# Altium schematic sheet Controller.SchDoc
size 297 x 209 mm; SheetNumber: 4; SheetTotal: 11
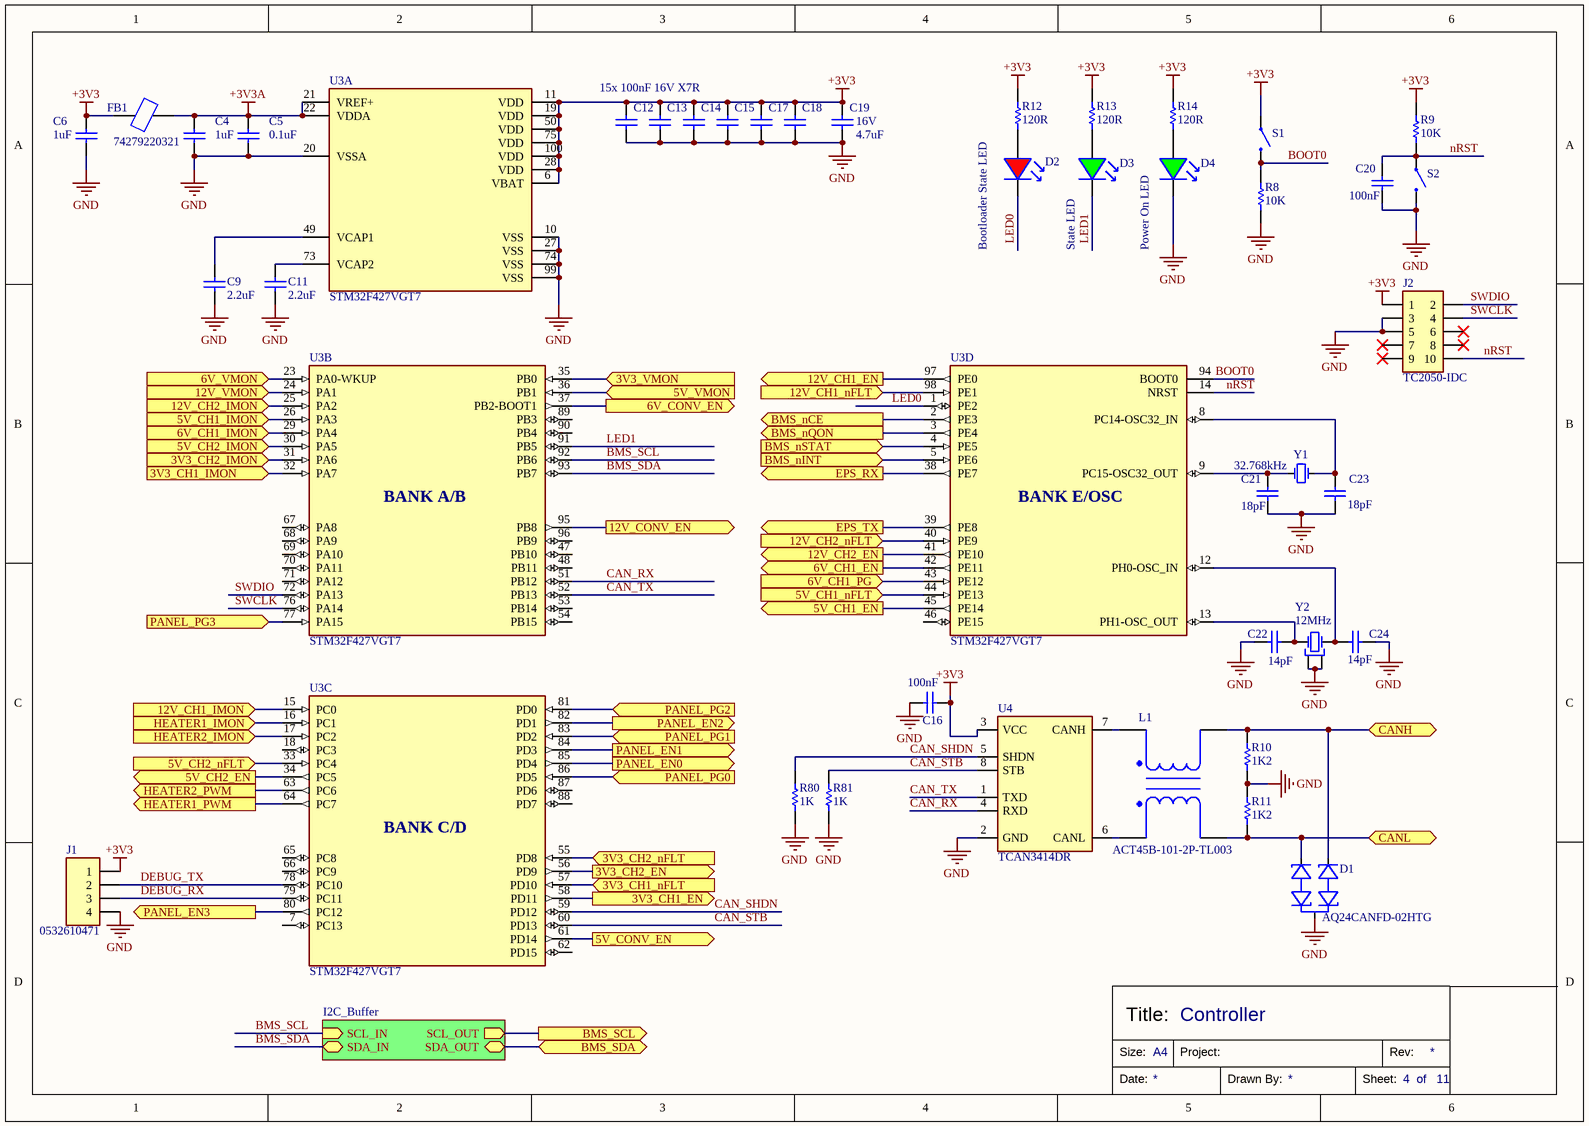
[diagram p0: Controller.SchDoc]

## Parts
C4  Capacitance: 1uF  [CAPC0603X040]  (hidden comment: CL10B105KO8NNNC)
C5  Capacitance: 0.1uF  [CAPC0402X020]  (hidden comment: CL05B104KB5NNNC)
C6  Capacitance: 1uF  [CAPC0603X040]  (hidden comment: CL10B105KO8NNNC)
C9  Capacitance: 2.2uF  [CAPC0805X060]  (hidden comment: CL21A225KBFNNNE)
C11  Capacitance: 2.2uF  [CAPC0805X060]  (hidden comment: CL21A225KBFNNNE)
C12  CL05B104KB5NNNC  [CAPC0402X020]  (value not drawn)
C13  CL05B104KB5NNNC  [CAPC0402X020]  (value not drawn)
C14  CL05B104KB5NNNC  [CAPC0402X020]  (value not drawn)
C15  CL05B104KB5NNNC  [CAPC0402X020]  (value not drawn)
C16  Capacitance: 100nF  [CAPC0603X040]  (hidden comment: C0603C104K5RACTU)
C17  CL05B104KB5NNNC  [CAPC0402X020]  (value not drawn)
C18  CL05B104KB5NNNC  [CAPC0402X020]  (value not drawn)
C19  Voltage Rating: 16V  Capacitance: 4.7uF  [CAPC0805X060]  (hidden comment: CL21B475KOFNFNE)
C20  Capacitance: 100nF  [CAPC0603X040]  (hidden comment: C0603C104K5RACTU)
C21  Capacitance: 18pF  [CAPC0402X020]  (hidden comment: KGM05ACG1H180FH)
C22  Capacitance: 14pF  [CAPC0402X020]  (hidden comment: GJM1555C1H140FB01D)
C23  Capacitance: 18pF  [CAPC0402X020]  (hidden comment: KGM05ACG1H180FH)
C24  Capacitance: 14pF  [CAPC0402X020]  (hidden comment: GJM1555C1H140FB01D)
D1  AQ24CANFD-02HTG  [SOT23-3 IC]
D2  LTST-C170EKT  [LEDR_0805]  (value not drawn)
D3  LTST-C170GKT  [LEDG_0805]  (value not drawn)
D4  LTST-C170GKT  [LEDG_0805]  (value not drawn)
FB1  74279220321  [74279220321]
J1  0532610471  [0532610471]
J2  TC2050-IDC  [TC2050-IDC]  (no BOM)
L1  ACT45B-101-2P-TL003  [ACT45B-101-2P-TL003]
R8  Resistance: 10K  [RESC0805]  (hidden comment: RMCF0805FT10K0)
R9  Resistance: 10K  [RESC0805]  (hidden comment: RMCF0805FT10K0)
R10  Resistance: 1K2  [RESC0603]  (hidden comment: RMCF0603FT1K20)
R11  Resistance: 1K2  [RESC0603]  (hidden comment: RMCF0603FT1K20)
R12  Resistance: 120R  [RESC0805]  (hidden comment: RMCF0805FT120R)
R13  Resistance: 120R  [RESC0805]  (hidden comment: RMCF0805FT120R)
R14  Resistance: 120R  [RESC0805]  (hidden comment: RMCF0805FT120R)
R80  Resistance: 1K  [RESC0805]  (hidden comment: RNCP0805FTD1K00)
R81  Resistance: 1K  [RESC0805]  (hidden comment: RNCP0805FTD1K00)
S1  B3U-1000P  [B3U-1000P]  (value not drawn)
S2  B3U-1000P  [B3U-1000P]  (value not drawn)
U3  STM32F427VGT7  [STM32F427VGT7]  (parts A,B,C,D of 4)
U4  TCAN3414DR  [SOIC-8]
Y1  Frequency: 32.768kHz  [CM7VT1A32.768KHZ125PF20PPMTBQAT3]  (hidden comment: CM7VT1A32.768KHZ125PF20PPMTBQAT3)
Y2  Frequency: 12MHz  [830069882]  (hidden comment: 830069882)

## Sub-sheets
I2C_Buffer = I2C_Buffer: SCL_IN (in), SDA_IN (bidir), SCL_OUT (out), SDA_OUT (bidir)

## Ports
3V3_CH1_EN (out, see PDM[4A], 3V3_Supply[4B]), 3V3_CH1_IMON (in, see PDM[4A], 3V3_Supply[2D]), 3V3_CH1_nFLT (in, see PDM[4A], 3V3_Supply[4B]), 3V3_CH2_EN (out, see PDM[4A], 3V3_Supply[4C]), 3V3_CH2_IMON (in, see PDM[4A], 3V3_Supply[5D]), 3V3_CH2_nFLT (in, see PDM[4A], 3V3_Supply[4C]), 3V3_VMON (in, see PDM[4A], 3V3_Supply[2C]), 5V_CH1_EN (out, see PDM[4B], 5V_Supply[4B]), 5V_CH1_IMON (in, see PDM[4B], 5V_Supply[2D]), 5V_CH1_nFLT (in, see PDM[4B], 5V_Supply[4B]), 5V_CH2_EN (out, see PDM[4B], 5V_Supply[4C]), 5V_CH2_IMON (in, see PDM[4B], 5V_Supply[4D]), 5V_CH2_nFLT (in, see PDM[4B], 5V_Supply[4C]), 5V_CONV_EN (out, see PDM[4B], 5V_Supply[1B]), 5V_VMON (in, see PDM[4B], 5V_Supply[2C]), 6V_CH1_EN (out, see PDM[4C], 6V_Supply[3C]), 6V_CH1_IMON (in, see PDM[4C], 6V_Supply[2D]), 6V_CH1_PG (in, see PDM[4C], 6V_Supply[4C]), 6V_CONV_EN (out, see PDM[4C], 6V_Supply[1B]), 6V_VMON (in, see PDM[4C], 6V_Supply[2C]), 12V_CH1_EN (out, see PDM[4C], 12V_Supply[4B]), 12V_CH1_IMON (in, see PDM[4D], 12V_Supply[2D]), 12V_CH1_nFLT (in, see PDM[4C], 12V_Supply[4B]), 12V_CH2_EN (out, see PDM[4C], 12V_Supply[4C]), 12V_CH2_IMON (in, see PDM[4D], 12V_Supply[4D]), 12V_CH2_nFLT (in, see PDM[4C], 12V_Supply[4C]), 12V_CONV_EN (out, see PDM[4C], 12V_Supply[1B]), 12V_VMON (in, see PDM[4C], 12V_Supply[2C]), BMS_nCE (out, see PDM[3B]), BMS_nINT (in, see PDM[3B]), BMS_nQON (out, see PDM[3B]), BMS_nSTAT (in, see PDM[3B]), BMS_SCL (out, see PDM[3B]), BMS_SDA (bidir, see PDM[3B]), CANH (bidir, see PDM[3C], PC104[2B]), CANL (bidir, see PDM[3C], PC104[2B]), EPS_RX (out, see PDM[3C], PC104[3B]), EPS_TX (out, see PDM[3C], PC104[3B]), HEATER1_IMON (in, see PDM[3A]), HEATER1_PWM (out, see PDM[3A]), HEATER2_IMON (in, see PDM[3B]), HEATER2_PWM (out, see PDM[3B]), PANEL_EN0 (out, see PDM[3B]), PANEL_EN1 (out, see PDM[3B]), PANEL_EN2 (out, see PDM[3B]), PANEL_EN3 (out, see PDM[3B]), PANEL_PG0 (in, see PDM[3B]), PANEL_PG1 (in, see PDM[3B]), PANEL_PG2 (in, see PDM[3B]), PANEL_PG3 (in, see PDM[3B])

## Nets
+3V3: C6.2 C12.2 C13.2 C14.2 C15.2 C16.2 C17.2 C18.2 C19.2 FB1.1 J1.1 J2.1 R9.2 R12.2 R13.2 R14.2 S1.1 U3.6(VBAT) U3.11(VDD) U3.19(VDD) U3.28(VDD) U3.50(VDD) U3.75(VDD) U3.100(VDD) U4.3(VCC)
+3V3A: C4.2 C5.2 FB1.2 U3.21(VREF+) U3.22(VDDA)
GND: C4.1 C5.1 C6.1 C9.1 C11.1 C12.1 C13.1 C14.1 C15.1 C16.1 C17.1 C18.1 C19.1 C20.1 C21.1 C22.1 C23.2 C24.1 D1.3 D4.K J1.4 J2.3 J2.5 R8.1 R10.1 R11.2 R80.1 R81.1 S2.2 U3.10(VSS) U3.20(VSSA) U3.27(VSS) U3.74(VSS) U3.99(VSS) U4.2(GND) Y2.2(OSC1) Y2.4(OSC1)
3V3_CH1_EN: U3.58(PD11) ; port 3V3_CH1_EN
3V3_CH1_IMON: U3.32(PA7) ; port 3V3_CH1_IMON
3V3_CH1_nFLT: U3.57(PD10) ; port 3V3_CH1_nFLT
3V3_CH2_EN: U3.56(PD9) ; port 3V3_CH2_EN
3V3_CH2_IMON: U3.31(PA6) ; port 3V3_CH2_IMON
3V3_CH2_nFLT: U3.55(PD8) ; port 3V3_CH2_nFLT
3V3_VMON: U3.35(PB0) ; port 3V3_VMON
5V_CH1_EN: U3.45(PE14) ; port 5V_CH1_EN
5V_CH1_IMON: U3.26(PA3) ; port 5V_CH1_IMON
5V_CH1_nFLT: U3.44(PE13) ; port 5V_CH1_nFLT
5V_CH2_EN: U3.34(PC5) ; port 5V_CH2_EN
5V_CH2_IMON: U3.30(PA5) ; port 5V_CH2_IMON
5V_CH2_nFLT: U3.33(PC4) ; port 5V_CH2_nFLT
5V_CONV_EN: U3.61(PD14) ; port 5V_CONV_EN
5V_VMON: U3.36(PB1) ; port 5V_VMON
6V_CH1_EN: U3.42(PE11) ; port 6V_CH1_EN
6V_CH1_IMON: U3.29(PA4) ; port 6V_CH1_IMON
6V_CH1_PG: U3.43(PE12) ; port 6V_CH1_PG
6V_CONV_EN: U3.37(PB2-BOOT1) ; port 6V_CONV_EN
6V_VMON: U3.23(PA0-WKUP) ; port 6V_VMON
12V_CH1_EN: U3.97(PE0) ; port 12V_CH1_EN
12V_CH1_IMON: U3.15(PC0) ; port 12V_CH1_IMON
12V_CH1_nFLT: U3.98(PE1) ; port 12V_CH1_nFLT
12V_CH2_EN: U3.41(PE10) ; port 12V_CH2_EN
12V_CH2_IMON: U3.25(PA2) ; port 12V_CH2_IMON
12V_CH2_nFLT: U3.40(PE9) ; port 12V_CH2_nFLT
12V_CONV_EN: U3.95(PB8) ; port 12V_CONV_EN
12V_VMON: U3.24(PA1) ; port 12V_VMON
BMS_nCE: U3.2(PE3) ; port BMS_nCE
BMS_nINT: U3.5(PE6) ; port BMS_nINT
BMS_nQON: U3.3(PE4) ; port BMS_nQON
BMS_nSTAT: U3.4(PE5) ; port BMS_nSTAT
BMS_SCL: U3.92(PB6) ; sheet I2C_Buffer/SCL_IN
BMS_SCL: port BMS_SCL, sheet I2C_Buffer/SCL_OUT  [a separate net that carries the same name]
BMS_SDA: U3.93(PB7) ; sheet I2C_Buffer/SDA_IN
BMS_SDA: port BMS_SDA, sheet I2C_Buffer/SDA_OUT  [a separate net that carries the same name]
BOOT0: R8.2 S1.2 U3.94(BOOT0)
CAN_RX: U3.51(PB12) U4.4(RXD)
CAN_SHDN: R80.2 U3.59(PD12) U4.5(SHDN)
CAN_STB: R81.2 U3.60(PD13) U4.8(STB)
CAN_TX: U3.52(PB13) U4.1(TXD)
CANH: D1.1 L1.4 R10.2 ; port CANH
CANL: D1.2 L1.3 R11.1 ; port CANL
DEBUG_RX: J1.3 U3.79(PC11)
DEBUG_TX: J1.2 U3.78(PC10)
EPS_RX: U3.38(PE7) ; port EPS_RX
EPS_TX: U3.39(PE8) ; port EPS_TX
HEATER1_IMON: U3.16(PC1) ; port HEATER1_IMON
HEATER1_PWM: U3.64(PC7) ; port HEATER1_PWM
HEATER2_IMON: U3.17(PC2) ; port HEATER2_IMON
HEATER2_PWM: U3.63(PC6) ; port HEATER2_PWM
LED0: D2.K U3.1(PE2)
LED1: D3.K U3.91(PB5)
nRST: C20.2 J2.10 R9.1 S2.1 U3.14(NRST)
PANEL_EN0: U3.85(PD4) ; port PANEL_EN0
PANEL_EN1: U3.84(PD3) ; port PANEL_EN1
PANEL_EN2: U3.82(PD1) ; port PANEL_EN2
PANEL_EN3: U3.80(PC12) ; port PANEL_EN3
PANEL_PG0: U3.86(PD5) ; port PANEL_PG0
PANEL_PG1: U3.83(PD2) ; port PANEL_PG1
PANEL_PG2: U3.81(PD0) ; port PANEL_PG2
PANEL_PG3: U3.77(PA15) ; port PANEL_PG3
SWCLK: J2.4 U3.76(PA14)
SWDIO: J2.2 U3.72(PA13)
NetC9_2: C9.2 U3.49(VCAP1)
NetC11_2: C11.2 U3.73(VCAP2)
NetC21_2: C21.2 U3.9(PC15-OSC32_OUT) Y1.1(OSC1)
NetC22_2: C22.2 U3.13(PH1-OSC_OUT) Y2.1(OSC1)
NetC23_1: C23.1 U3.8(PC14-OSC32_IN) Y1.2(OSC2)
NetC24_2: C24.2 U3.12(PH0-OSC_IN) Y2.3(OSC2)
NetD2_A: D2.A R12.1
NetD3_A: D3.A R13.1
NetD4_A: D4.A R14.1
NetL1_1: L1.1 U4.7(CANH)
NetL1_2: L1.2 U4.6(CANL)

Not connected (* = marked no-connect by the designer): J2 6* 7* 8* 9*; U3 7(PC13) 18(PC3) 46(PE15) 47(PB10) 48(PB11) 53(PB14) 54(PB15) 62(PD15) 65(PC8) 66(PC9) 67(PA8) 68(PA9) 69(PA10) 70(PA11) 71(PA12) 87(PD6) 88(PD7) 89(PB3) 90(PB4) 96(PB9)

## Notes on the sheet
- 15x 100nF 16V X7R
- Bootloader State LED
- (near D3) State LED
- (near D4) Power On LED
- Controller
- Size:
- Title:
- A4
- Project:
- Rev:
- Date:
- Drawn By:
- Sheet:
- of
- (in symbol STM32F427VGT7, part B) BANK A/B
- (in symbol STM32F427VGT7, part C) BANK C/D
- (in symbol STM32F427VGT7, part D) BANK E/OSC

## Library data of the parts
C4 C6 = CAPC0603: 1 µF ±10% 16V Ceramic Capacitor X7R 0603 (1608 Metric); Manufacturer Part Number: CL10B105KO8NNNC; Tolerance: 10%; Distributor Part number: 1276-1019-1-ND; Case Code: 0603; Voltage Rating: 16V; Distributor: Digikey
C5 = CL05B104KB5NNNC: 0.1 µF ±10% 50V Ceramic Capacitor X7R 0402 (1005 Metric); Part Number: CL05B104KB5NNNC; Tolerance: 10%; Distributor Part Number: 1276-CL05B104KB5NNNCCT-ND; Case Code: 0402; Distributor: Digikey; Voltage Rating: 50V
C9 C11 = CL21A225KBFNNNE: 2.2uF ±10% 25V Ceramic Capacitor X7R 0805 (2012 Metric); Part Number: CL21A225KBFNNNE; Distributor Part Number: 1276-6702-1-ND; Tolerance: 10%; Case Code: 0805; Distributor: Digikey; Voltage Rating: 25V
C12-C15 C17 C18 = CL05B104KB5NNNC: 0.1 µF ±10% 50V Ceramic Capacitor X7R 0402 (1005 Metric); Capacitance: 0.1uF; Part Number: CL05B104KB5NNNC; Tolerance: 10%; Distributor Part Number: 1276-CL05B104KB5NNNCCT-ND; Case Code: 0402; Distributor: Digikey; Voltage Rating: 50V
C16 C20 = C0603C104K5RACTU: 0.1 µF ±10% 50V Ceramic Capacitor X7R 0603 (1608 Metric); Tolerance: 10%; Distributor Part Number: 399-C0603C104K5RACTUCT-ND; Case Code: 0603; Voltage Rating: 50V; Distributor: Digikey; Part Number: C0603C104K5RACTU
C19 = CL21B475KOFNFNE: 4.7 µF ±10% 16V Ceramic Capacitor X7R 0805 (2012 Metric); Distributor Part Number: 1276-2970-1-ND; Tolerance: 10%; Case Code: 0805; Distributor: Digikey; Part Number: CL21B475KOFNFNE
C21 C23 = CAPC0402: 18 pF ±1% 50V Ceramic Capacitor C0G, NP0 0402 (1005 Metric); Manufacturer Part Number: KGM05ACG1H180FH; Tolerance: 1%; Distributor Part Number: 478-KGM05ACG1H180FHCT-ND; Case Code: 0402; Distributor: Digikey; Voltage Rating: 50V
C22 C24 = CAPC0402: 14 pF ±1% 50V Ceramic Capacitor C0G, NP0 0402 (1005 Metric); Manufacturer Part Number: GJM1555C1H140FB01D; Tolerance: 1%; Distributor Part Number: 2266-GJM1555C1H140FB01DTR-ND; Case Code: 0402; Distributor: Digikey; Voltage Rating: 50V
D1 = AQ24CANFD-02HTG: 50V Clamp 3A (8/20µs) Ipp Tvs Diode Surface Mount SOT-23-3; Qualification: AEC-Q101; Voltage - Reverse Standoff (Typ): 24V; Voltage - Breakdown (Min): 26.7V; Power - Peak Pulse: 200W; Capacitance: 11.5pF @ 1MHz; Part Number: AQ24CANFD-02HTG; Distributor Part Number: F10993CT-ND; Distributor: Digikey; Operating Temperature: -40°C ~ 150°C; Voltage - Clamping (Max): 50V; Current - Peak Pulse (10us/1000us): 3A
D2 = LEDR0805: Red 621nm LED Indication - Discrete 2V 0805 (2012 Metric); Manufacturer Part Number: LTST-C170EKT; Distributor Part Number: 160-1178-1-ND; Colour: Red; Operating Temperature: *; Distributor: Digikey
D3 D4 = LEDG0805: Green 569nm LED Indication - Discrete 2.1V 0805 (2012 Metric); Manufacturer Part Number: LTST-C170GKT; Distributor Part Number: 160-1179-1-ND; Colour: Green; Operating Temperature: *; Distributor: Digikey
FB1 = 74279220321: Ferrite Bead 320 Ohms @ 100 MHz 1 Ferrite Bead 0805 (2012 Metric) 2.5A 50mOhm; Part Number: 74279220321; Distributor Part Number: 732-6125-1-ND; Distributor: Digikey; Operating Temperature: -55°C ~ 125°C; Impedance: 320 Ohms @ 100 MHz; Current Rating: 2.5A; DCR: 50mOhm
J1 = 0532610471: Connector Header Surface Mount, Right Angle 4 position 0.049" (1.25mm) Molex Picoblade; Number of Positions: 4; Max Current Per Contact: 1A; Part Number: 0532610471; Distributor: Digikey; Distributor Part Number: WM7622CT-ND; Number of Rows: 2
J2 = TC2050-IDC: JTAG Pogo Programmer Pads; Programmer Part Number: TC2050-IDC
L1 = ACT45B-101-2P-TL003: Common Mode Choke 100 µH @ 100 kHz 2 Line Surface Mount 5.8 kOhms @ 10 MHz 150mA DCR 2Ohm; Inductance: 100uH @ 100kHz; Voltage Rating (DC): 50V; Qualification: AEC-Q200; Part Number: ACT45B-101-2P-TL003; Distributor: Digikey; Distributor Part Number: 445-3959-1-ND; Impedance: 5.8kohms @ 10MHz; Current Rating (Max): 150mA; DCR: 2Ohm; Operating Temperature: -40°C ~ 150°C
R8 R9 = RMCF0805FT10K0: 10 kOhms ±1% 0.125W, 1/8W Chip Resistor 0805 (2012 Metric) Automotive AEC-Q200 Thick Film; Tolerance: 1%; Distributor Part Number: RMCF0805FT10K0CT-ND; Case Code: 0805; Distributor: Digikey; Part Number: RMCF0805FT10K0
R10 R11 = RMCF0603FT1K20: 1.2 kOhms ±1% 0.1W, 1/10W Chip Resistor 0603 (1608 Metric) Automotive AEC-Q200 Thick Film; Part Number: RMCF0603FT1K20; Tolerance: 1%; Distributor: Digikey; Distributor Part Number: RMCF0603FT1K20CT-ND; Case Code: 0603
R12-R14 = RMCF0805FT120R: 120 Ohms ±1% 0.125W, 1/8W Chip Resistor 0805 (2012 Metric) Automotive AEC-Q200 Thick Film; Part Number: RMCF0805FT120R; Tolerance: 1%; Distributor Part Number: 738-RMCF0805FT120RCT-ND; Distributor: Digikey; Case Code: 0805
R80 R81 = RNCP0805FTD1K00: 1 kOhms ±1% 0.25W, 1/4W Chip Resistor 0805 (2012 Metric) Anti-Sulfur Thin Film; Manufacturer Part Number: RNCP0805FTD1K00; Tolerance: 1%; Distributor Part Number: RNCP0805FTD1K00CT-ND; Distributor: Digikey; Case Code: 0805
S1 S2 = B3U-1000P: Tactile Switch SPST-NO Top Actuated Surface Mount; Part Number: B3U-1000P; Distributor: Digikey; Distributor Part Number: SW1020CT-ND; Operating Temperature: -25°C ~ 70°C
U3 = STM32F427VGT7: ARM® Cortex®-M4 STM32F4 Microcontroller IC 32-Bit 180MHz 1MB (1M x 8) FLASH 100-LQFP (14x14); RAM Size: 256Kx8; Voltage - Supply: 1.8V ~ 3.6V; Part Number: STM32F427VGT7; Distributor Part Number: 497-16769-ND; Distributor: Digikey; Operating Temperature: -40°C ~ 105°C (TA); Speed: 180MHz
U4 = TCAN3414DR: 3.3 V CAN-FD transceiver, CAN/CAN-FD up to 8 Mb/s, ±58 V bus-fault tolerant, SOIC-8; Voltage - Supply: 3V ~ 3.6V; Data Rate: 8Mbps; Protocol: CANbus; Part Number: TCAN3414DR; Distributor: Digikey; Distributor Part Number: 296-TCAN3414DRCT-ND; Operating Temperature: -40°C ~ 125°C
Y1 = CM7VT1A32.768KHZ125PF20PPMTBQAT3: CRYSTAL 32.7680KHZ 12.5PF SMD; Qualification: AEC-Q200; ESR: 70kohm; Part Number: CM7VT1A32.768KHZ125PF20PPMTBQAT3; Distributor Part Number: 2195-CM7VT1A32.768KHZ125PF20PPMTBQAT3CT-ND; Distributor: Digikey; Operating Temperature: -40°C ~ 125°C; Load Capacitance: 12.5pF
Y2 = 830069882: Crystals 12.0 MHZ 18PF 20PPM 120OHM; Load Capacitance: 10pF; ESR: 100R; Distributor Part Number: 732-830069882CT-ND; Part Number: 830069882; Operating Temperature: -40C to 125C; Distributor: Digikey